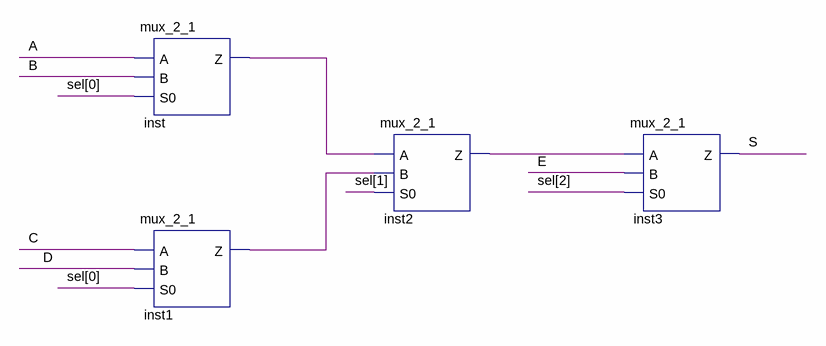
[diagram p0: schematic sheet]
// Quartus schematic mux_5x1_1b.bdf as structural Verilog: 4 symbols, 0 pins
module mux_5x1_1b (
);

  wire A, B, C, D, E, inst1_z, inst2_z, inst_z, S;
  wire [2:0] sel;

  mux_2_1 inst (.A(A), .B(B), .S0(sel[0]), .Z(inst_z));
  mux_2_1 inst1 (.A(C), .B(D), .S0(sel[0]), .Z(inst1_z));
  mux_2_1 inst2 (.A(inst_z), .B(inst1_z), .S0(sel[1]), .Z(inst2_z));
  mux_2_1 inst3 (.A(inst2_z), .B(E), .S0(sel[2]), .Z(S));
endmodule
